# Altium schematic sheet Select&Measure.SchDoc
size A4
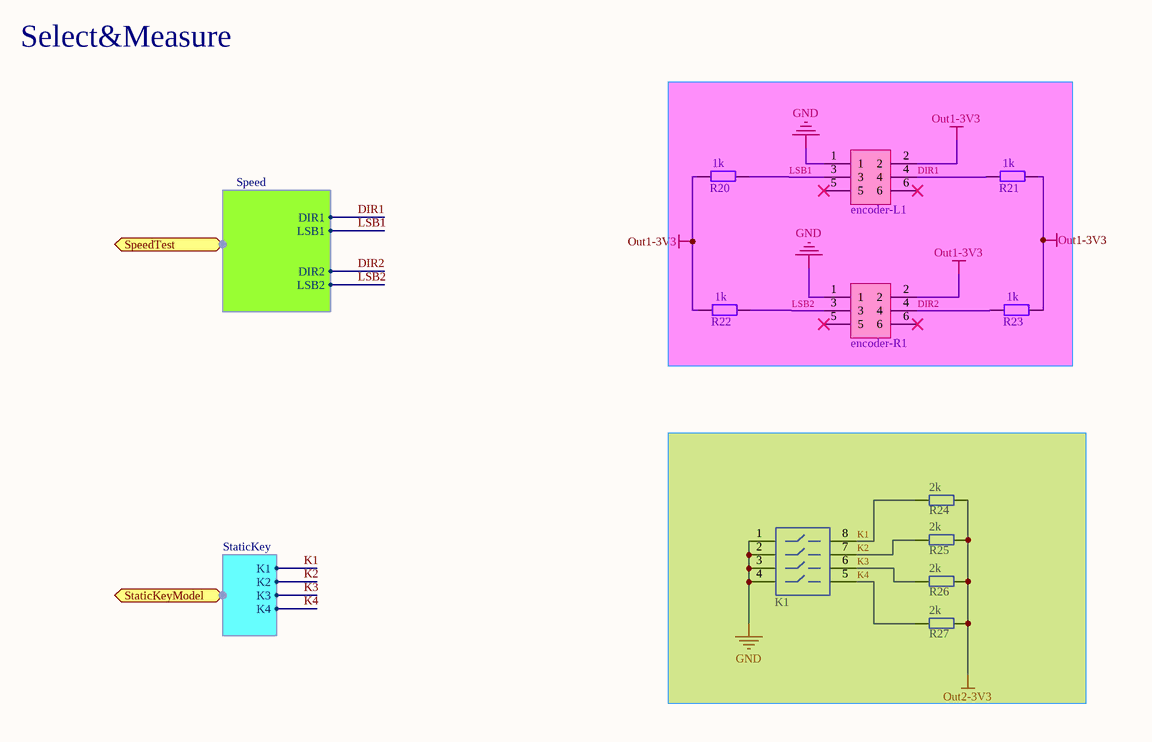
[diagram p0: Select&Measure.SchDoc]

## Parts
encoder-L1  编码器  [编码器]  (value not drawn)
encoder-R1  编码器  [编码器]  (value not drawn)
K1  拨码开关  [拨码开关]  (value not drawn)
R20  1k  [0805电阻]
R21  1k  [0805电阻]
R22  1k  [0805电阻]
R23  1k  [0805电阻]
R24  2k  [0805电阻]
R25  2k  [0805电阻]
R26  2k  [0805电阻]
R27  2k  [0805电阻]

## Ports
SpeedTest (harness Speed), StaticKeyModel (harness StaticKey)

## Harnesses
Speed: DIR1, LSB1, LSB2, DIR2
StaticKey: K1, K2, K3, K4

## Nets
GND: encoder-L1.1 encoder-R1.1 K1.1 K1.2 K1.3 K1.4
Out1-3V3: encoder-L1.2 encoder-R1.2 R20.1 R21.2 R22.1 R23.2
Out2-3V3: R24.2 R25.2 R26.2 R27.2
DIR1: encoder-L1.4 R21.1 ; port SpeedTest.DIR1
DIR2: encoder-R1.4 R23.1 ; port SpeedTest.DIR2
K1: K1.8 R24.1 ; port StaticKeyModel.K1
K2: K1.7 R25.1 ; port StaticKeyModel.K2
K3: K1.6 R26.1 ; port StaticKeyModel.K3
K4: K1.5 R27.1 ; port StaticKeyModel.K4
LSB1: encoder-L1.3 R20.2 ; port SpeedTest.LSB1
LSB2: encoder-R1.3 R22.2 ; port SpeedTest.LSB2

Not connected (* = marked no-connect by the designer): encoder-L1 5* 6*; encoder-R1 5* 6*

## Notes on the sheet
- Select&Measure

## Library data of the parts
R20-R27 = 0805电阻